# EAGLE schematic P4-Temperatura_LM35 (EAGLE 9.6.2)
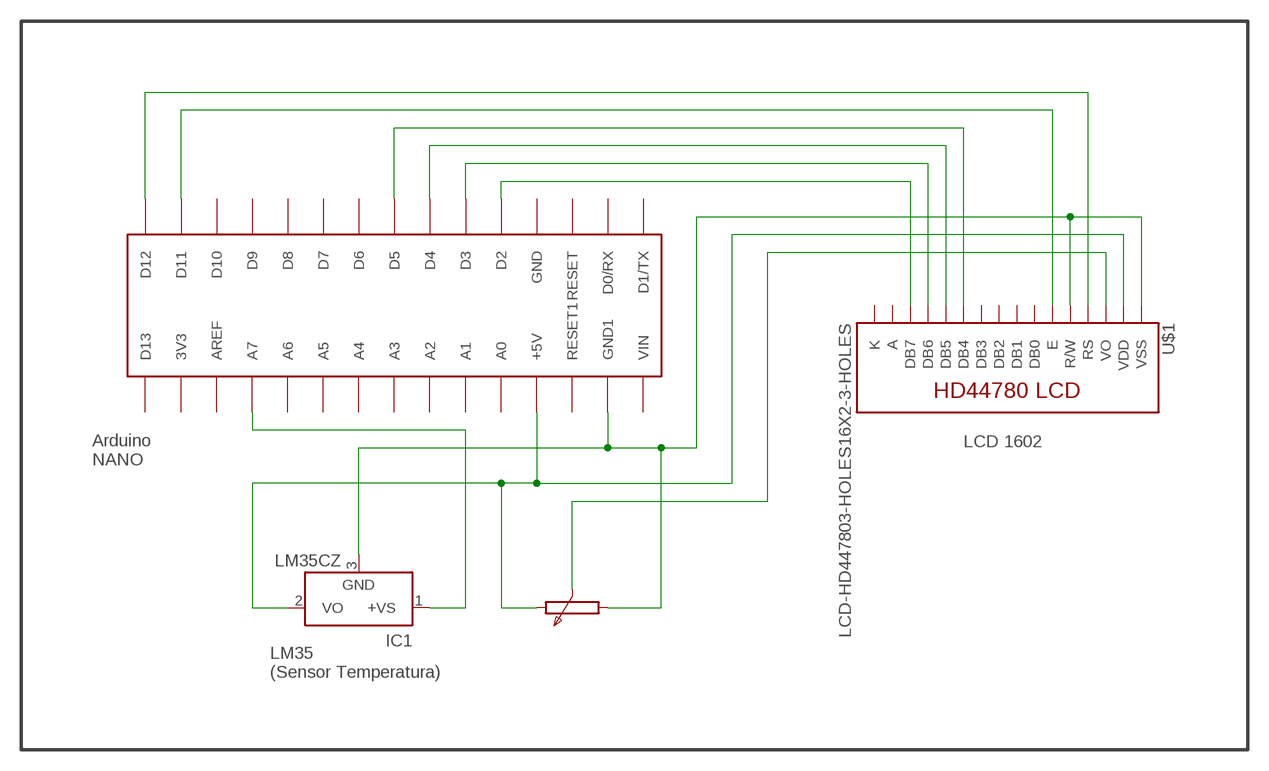
[diagram p0: schematic, sheet 1]

## Parts
IC1  LM35CZ  [TO92]
U$1  LCD-HD447803-HOLES16X2-3-HOLES  [LCD-16X2-3HOLES]
U$2  ARDUINONANO  [PDIP-32]

## Nets
N$1: U$1.14(DB7) U$2.D2
N$2: U$1.13(DB6) U$2.D3
N$3: U$1.12(DB5) U$2.D4
N$4: U$1.11(DB4) U$2.D5
N$5: U$1.6(E) U$2.D11
N$6: U$1.4(RS) U$2.D12
N$7: IC1.3(GND) U$1.1(VSS) U$1.5(R/W) U$2.GND1
N$8: IC1.2(VO) U$1.2(VDD) U$2.+5V
N$9: U$1.3(VO)
N$11: IC1.1(+VS) U$2.A7
Unconnected: U$1.7(DB0) U$1.8(DB1) U$1.9(DB2) U$1.10(DB3) U$2.3V3 U$2.A0 U$2.A1 U$2.A2 U$2.A3 U$2.A4 U$2.A5 U$2.A6 U$2.AREF U$2.D0/RX U$2.D1/TX U$2.D6 U$2.D7 U$2.D8 U$2.D9 U$2.D10 U$2.D13 U$2.GND U$2.RESET U$2.RESET1 U$2.VIN

## Notes on the sheet
- LCD 1602
- Arduino
  NANO
- LM35
  (Sensor Temperatura)

## Power pins joined to a net without a drawn wire
A: U$1.15(A)
K: U$1.16(K)

## Library data of the parts
IC1 = lm35:LM35: Single-Supply Centigrade Temperature Sensor Vout = (10mV/°C x Temp °C) +5mmmV Source: http://www.national.com/ds/LM/LM35.pdf
U$1 = HD44780LCD:LCD-HD44780
U$2 = jet-lib:ARDUINONANO